# Altium schematic sheet EPS_v6.SchDoc
size A0; PageSetup: Record=PageOptions|CenterHorizontal=True|CenterVertical=True|PrintScale=0.45|XCorrection=1.00|YCorrection=1.00|PrintKind=2|BorderSize=5000000|LeftOffset=1|BottomOffset=1|Orientation=2|PaperLength=1000|PaperWidth=1000|Scale=100|PaperSource=7|PrintQuality=-4|MediaType=1|DitherType=10|PrintScaleMode=1|PaperKind=A4
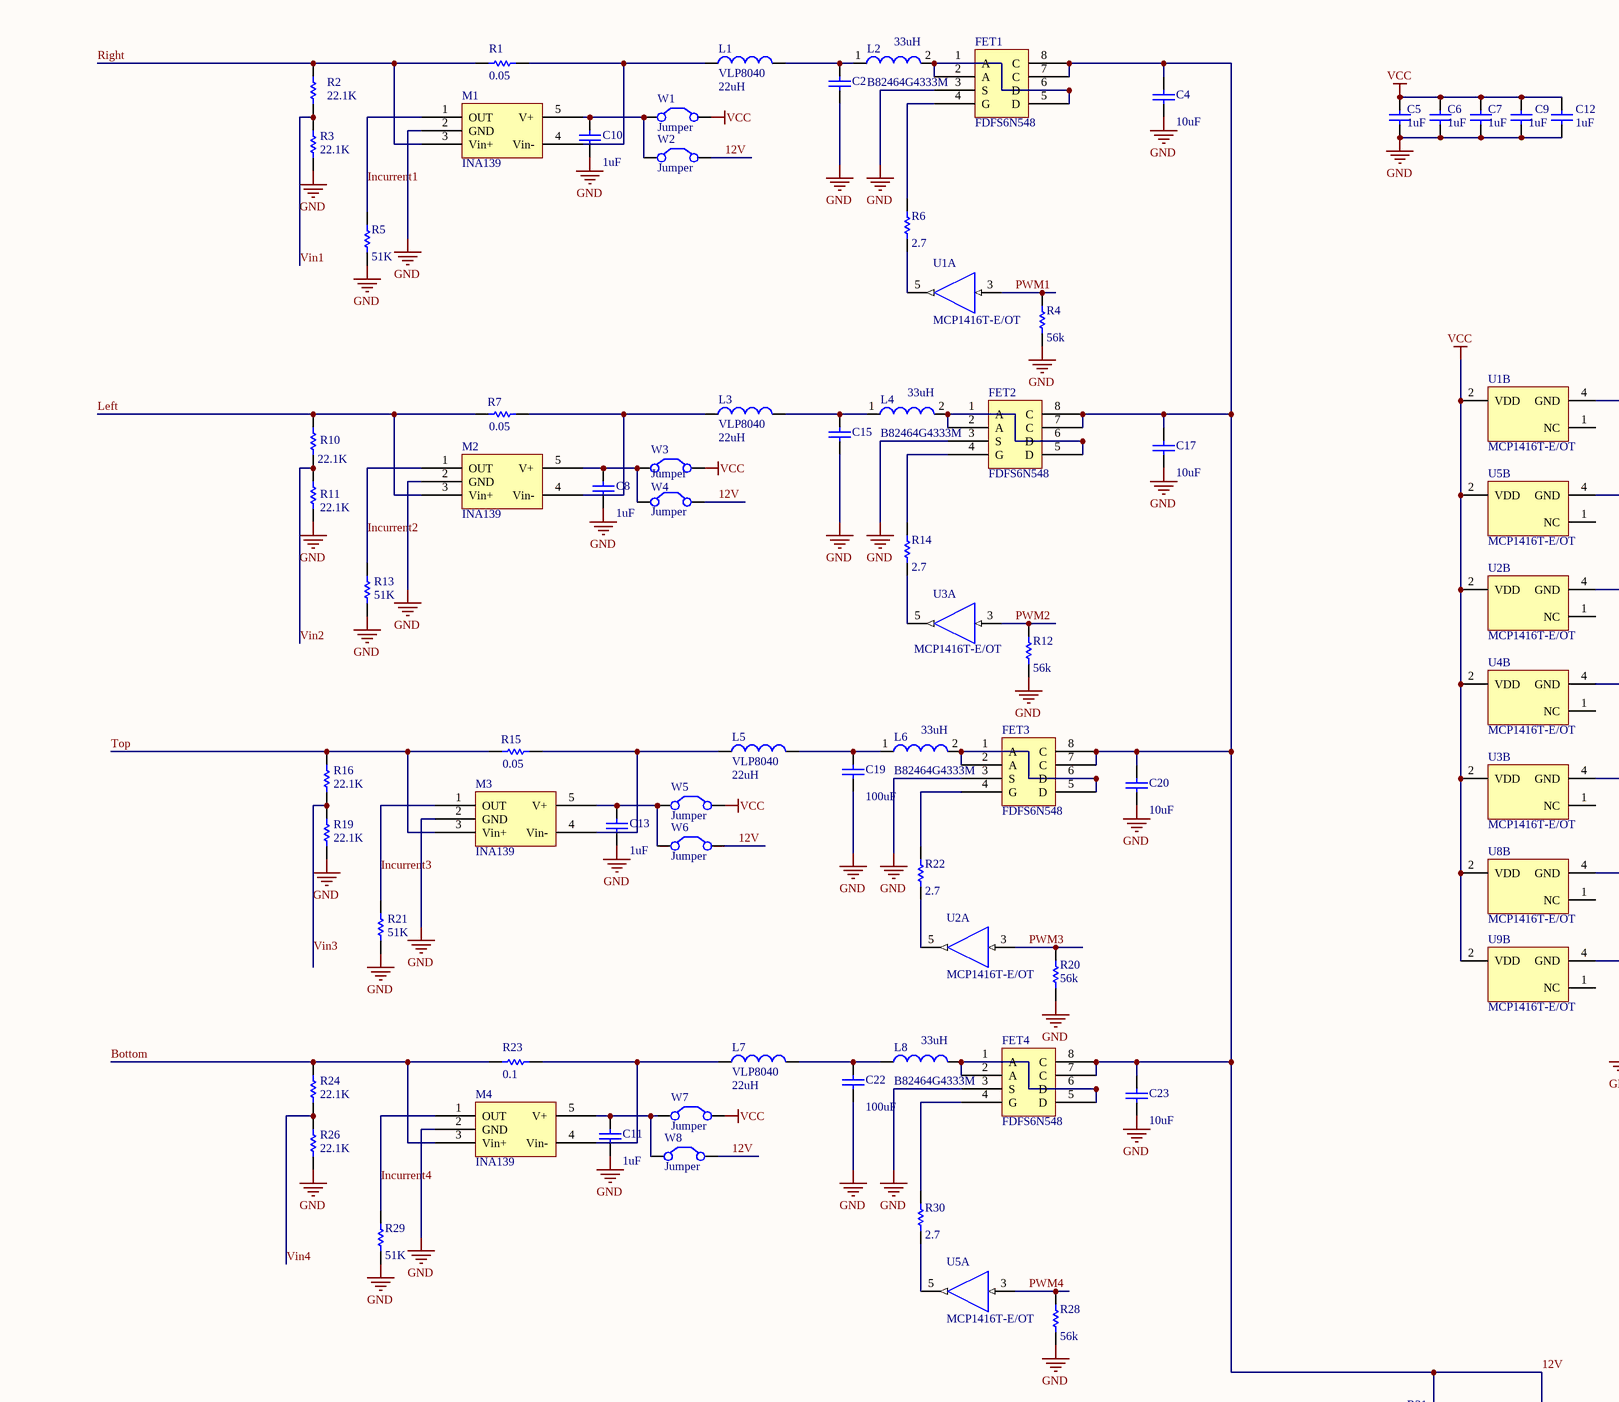
[diagram p0: EPS_v6.SchDoc, top left]
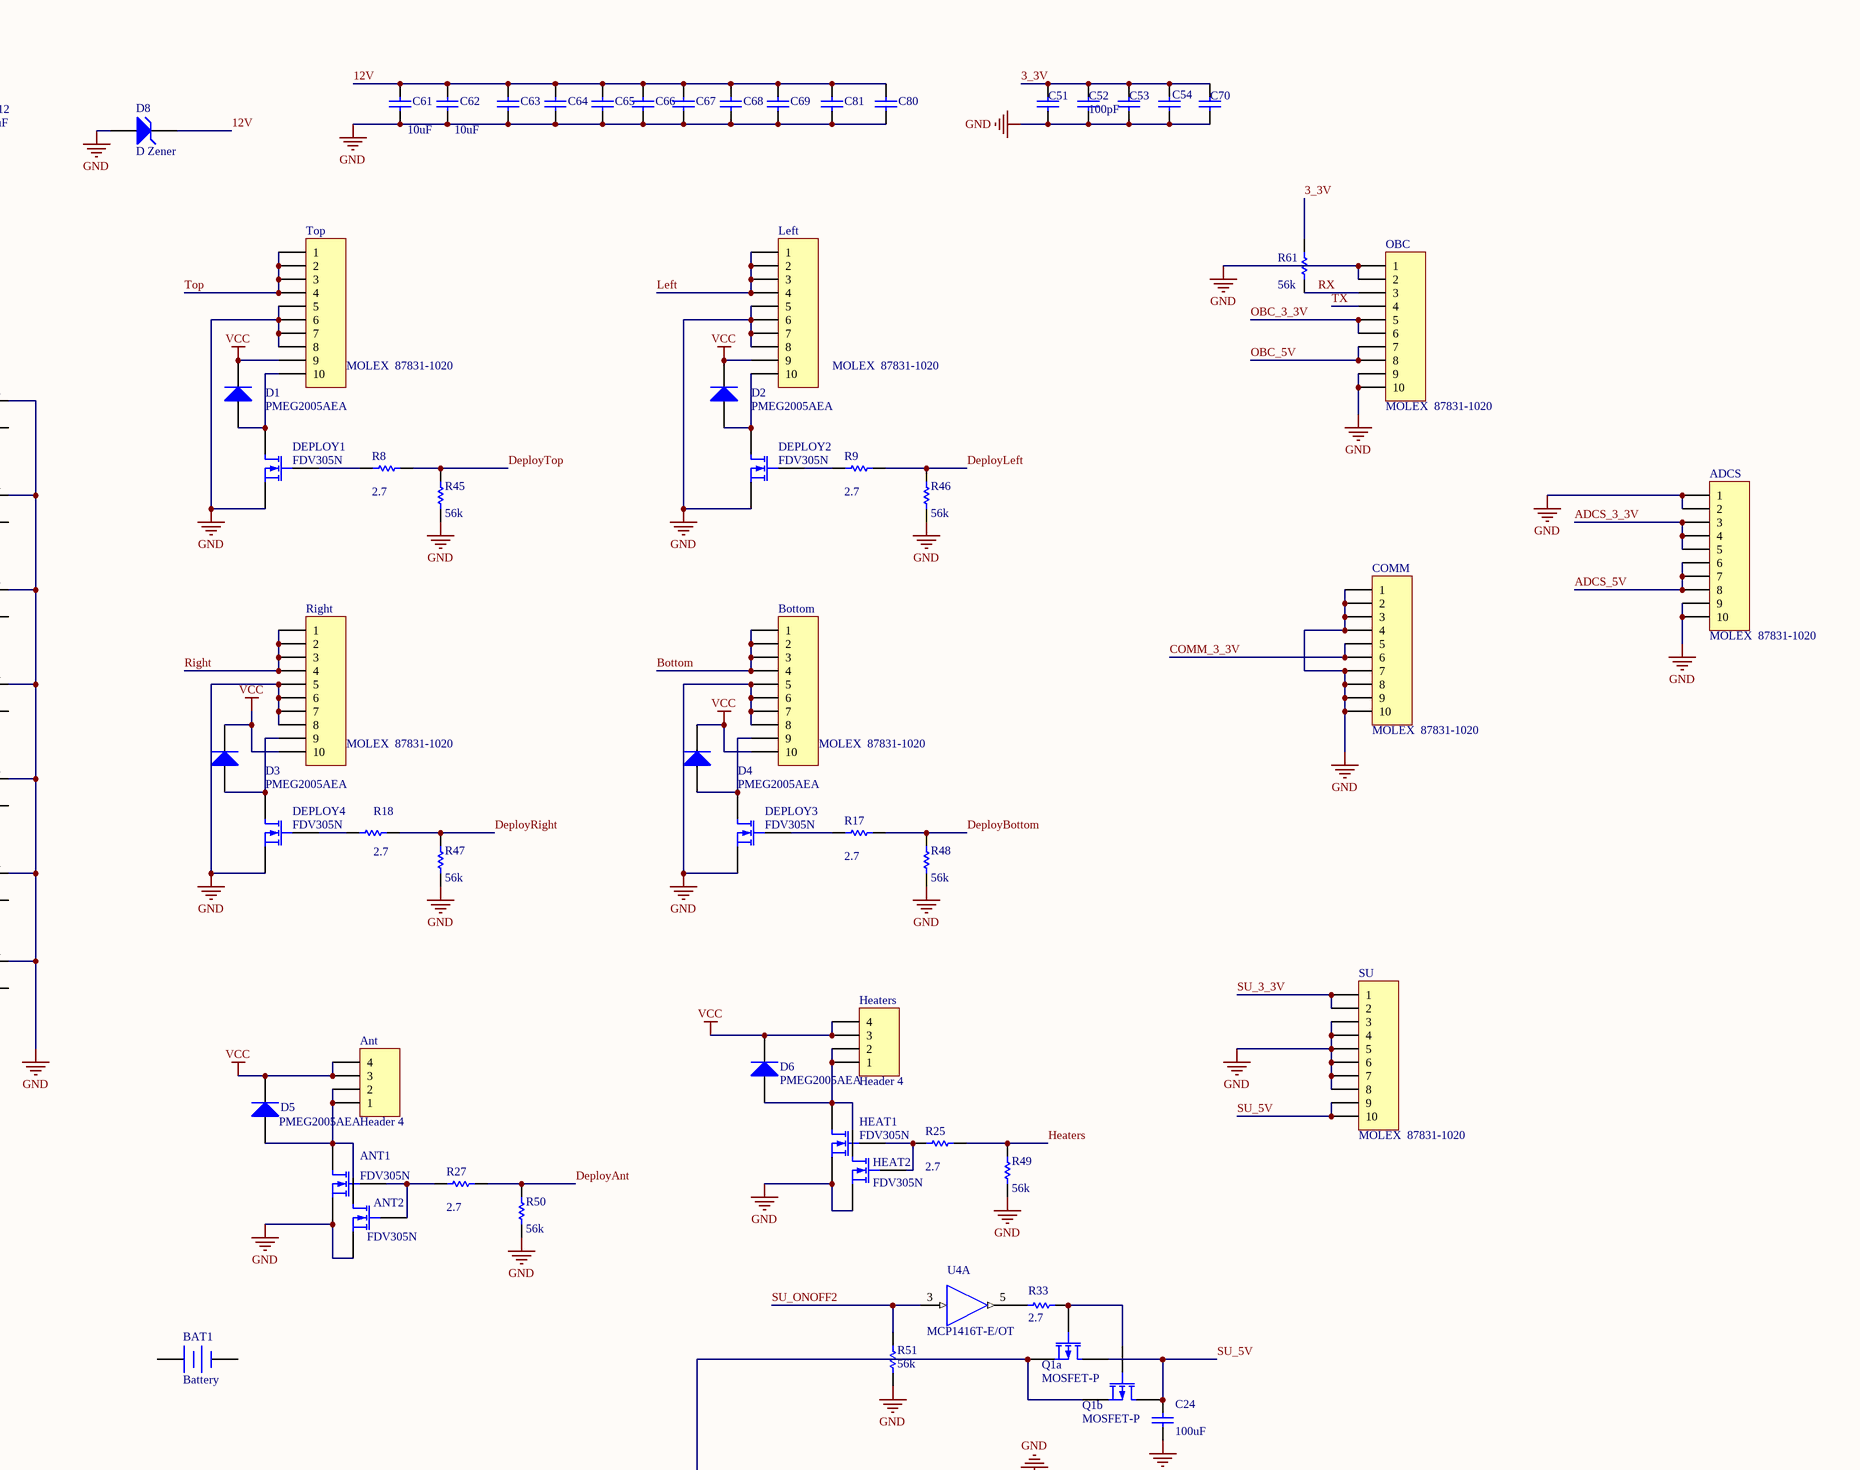
[diagram p1: EPS_v6.SchDoc, top right]
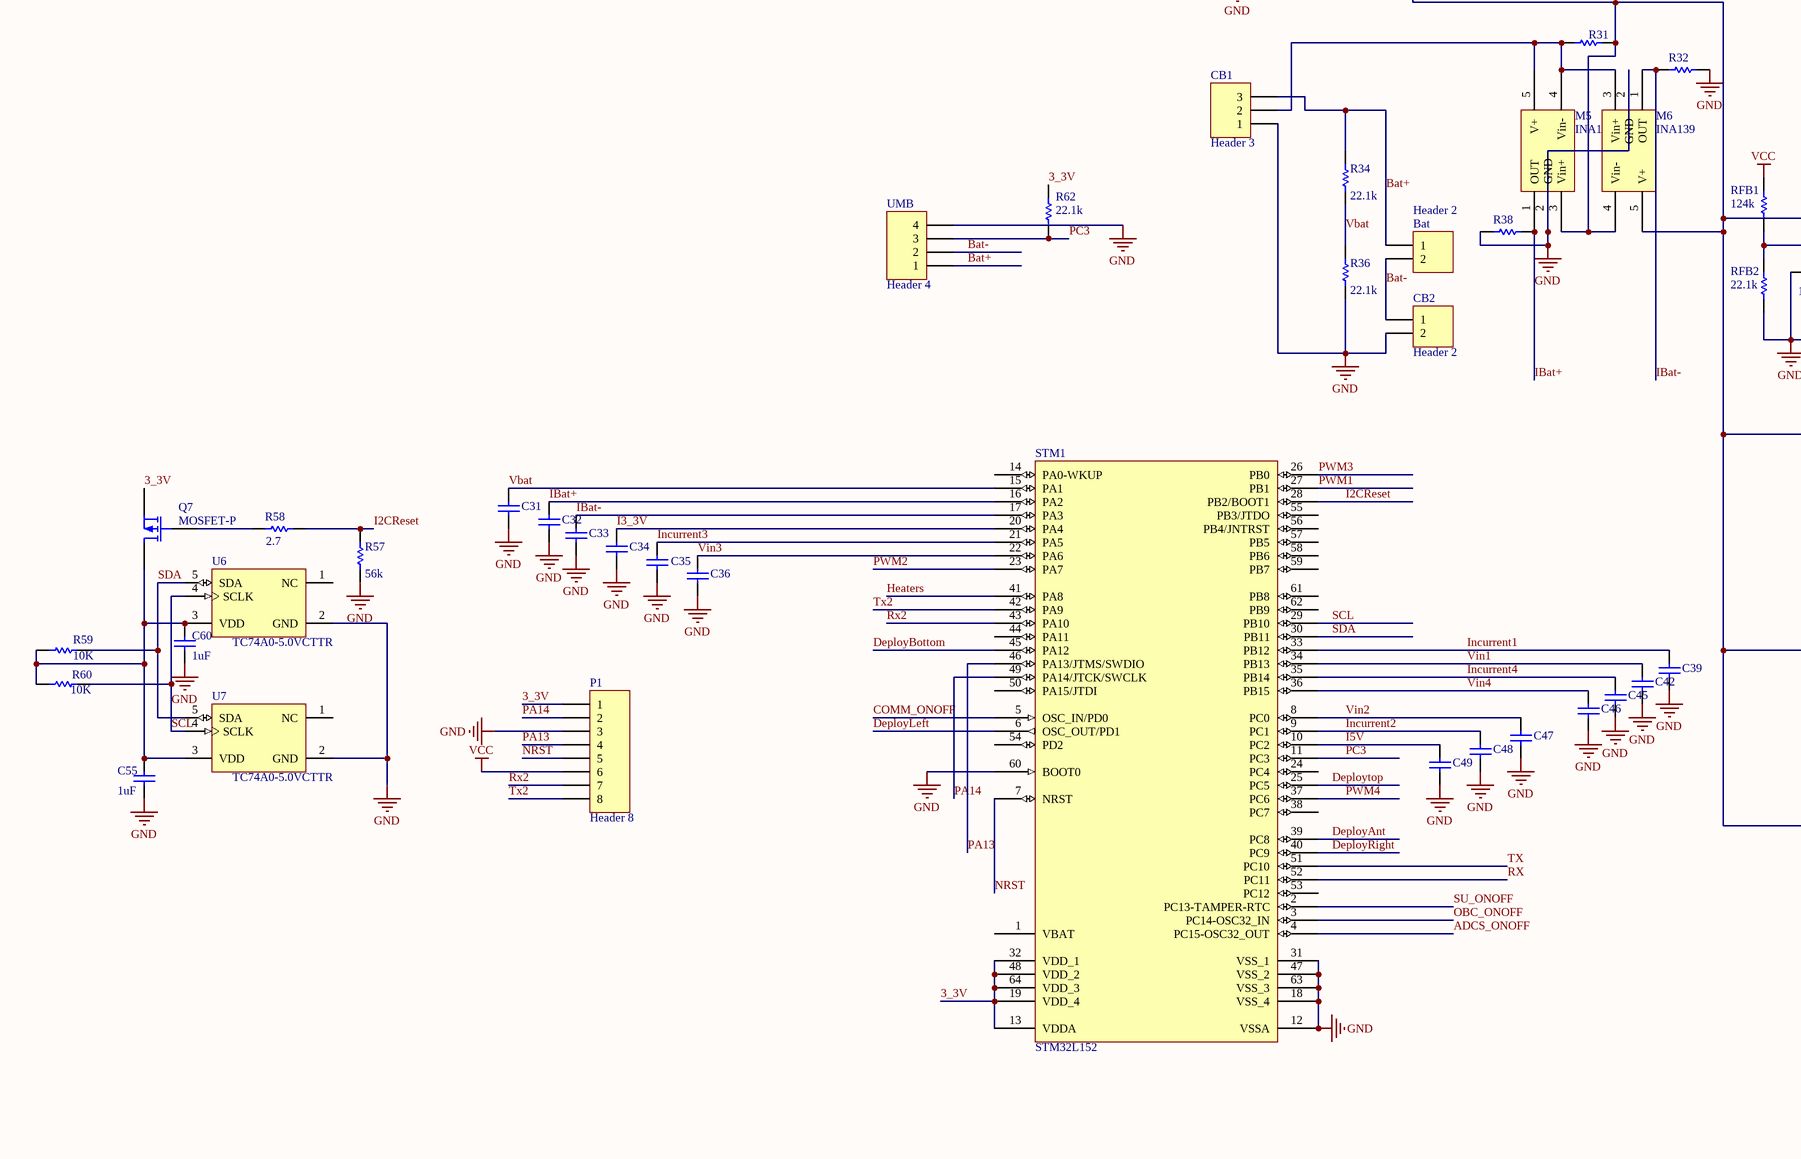
[diagram p2: EPS_v6.SchDoc, bottom left]
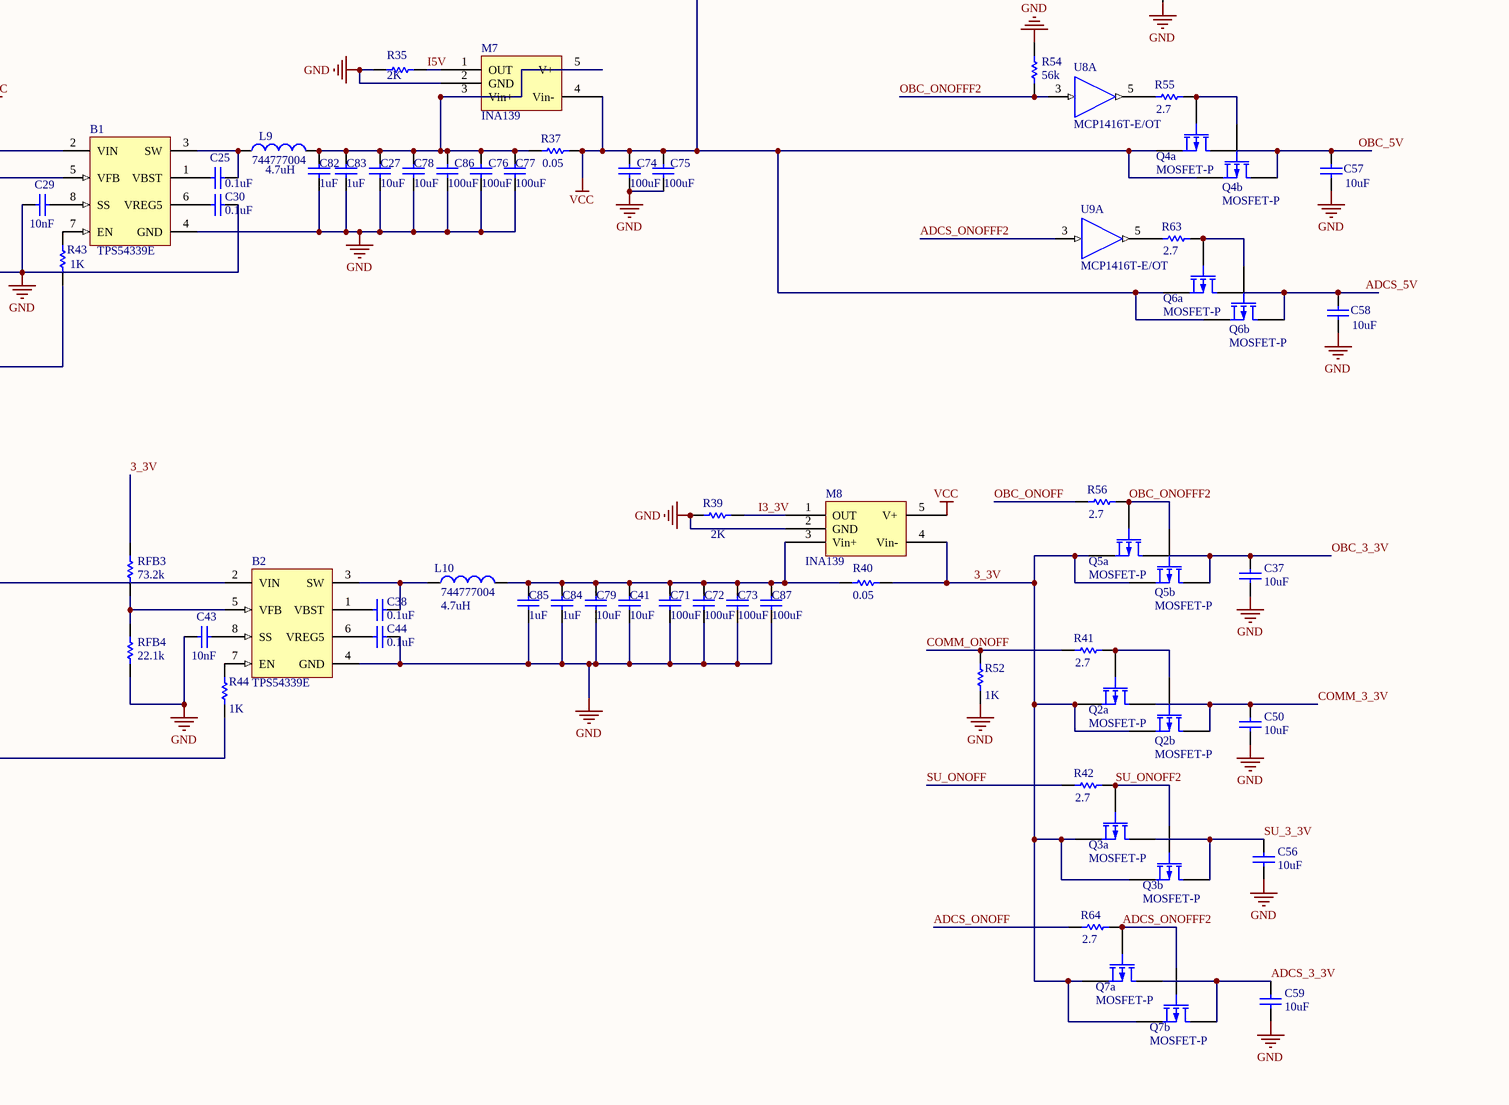
[diagram p3: EPS_v6.SchDoc, bottom right]

## Parts
ADCS  MOLEX  87831-1020  [2mm pitch con]
Ant  Header 4  [2mm4way2row]
ANT1  FDV305N  [SOT-23_M]
ANT2  FDV305N  [SOT-23_M]
B1  TPS54339E  [DDA]
B2  TPS54339E  [DDA]
Bat  Header 2  [Connector]
BAT1  Battery  [18650_pack]
Bottom  MOLEX  87831-1020  [2mm pitch con]
C2  Cap  [C1210_M]  (value not drawn)
C4  value 10uF  [C0805]  (hidden comment: Cap)
C5  value 1uF  [1608[0603]]  (hidden comment: Cap)
C6  value 1uF  [1608[0603]]  (hidden comment: Cap)
C7  value 1uF  [1608[0603]]  (hidden comment: Cap)
C8  value 1uF  [1608[0603]]  (hidden comment: Cap)
C9  value 1uF  [1608[0603]]  (hidden comment: Cap)
C10  value 1uF  [1608[0603]]  (hidden comment: Cap)
C11  value 1uF  [1608[0603]]  (hidden comment: Cap)
C12  value 1uF  [1608[0603]]  (hidden comment: Cap)
C13  value 1uF  [1608[0603]]  (hidden comment: Cap)
C15  Cap  [C1210_M]  (value not drawn)
C17  value 10uF  [C0805]  (hidden comment: Cap)
C19  value 100uF  [C1210_M]  (hidden comment: Cap)
C20  value 10uF  [C0805]  (hidden comment: Cap)
C22  value 100uF  [C1210_M]  (hidden comment: Cap)
C23  value 10uF  [C0805]  (hidden comment: Cap)
C24  value 100uF  [C0805]  (hidden comment: Cap)
C25  value 0.1uF  [1608[0603]]  (hidden comment: Cap)
C27  value 10uF  [C0805]  (hidden comment: Cap)
C29  value 10nF  [1608[0603]]  (hidden comment: Cap)
C30  value 0.1uF  [1608[0603]]  (hidden comment: Cap)
C31  Cap  [1608[0603]]  (value not drawn)
C32  Cap  [1608[0603]]  (value not drawn)
C33  Cap  [1608[0603]]  (value not drawn)
C34  Cap  [1608[0603]]  (value not drawn)
C35  Cap  [1608[0603]]  (value not drawn)
C36  Cap  [1608[0603]]  (value not drawn)
C37  value 10uF  [C0805]  (hidden comment: Cap)
C38  value 0.1uF  [1608[0603]]  (hidden comment: Cap)
C39  Cap  [1608[0603]]  (value not drawn)
C41  value 10uF  [C0805]  (hidden comment: Cap)
C42  Cap  [1608[0603]]  (value not drawn)
C43  value 10nF  [1608[0603]]  (hidden comment: Cap)
C44  value 0.1uF  [1608[0603]]  (hidden comment: Cap)
C45  Cap  [1608[0603]]  (value not drawn)
C46  Cap  [1608[0603]]  (value not drawn)
C47  Cap  [1608[0603]]  (value not drawn)
C48  Cap  [1608[0603]]  (value not drawn)
C49  Cap  [1608[0603]]  (value not drawn)
C50  value 10uF  [C0805]  (hidden comment: Cap)
C51  Cap  [1608[0603]]  (value not drawn)
C52  value 100pF  [1608[0603]]  (hidden comment: Cap)
C53  Cap  [1608[0603]]  (value not drawn)
C54  Cap  [C0805]  (value not drawn)
C55  value 1uF  [1608[0603]]  (hidden comment: Cap)
C56  value 10uF  [C0805]  (hidden comment: Cap)
C57  value 10uF  [C0805]  (hidden comment: Cap)
C58  value 10uF  [C0805]  (hidden comment: Cap)
C59  value 10uF  [C0805]  (hidden comment: Cap)
C60  value 1uF  [1608[0603]]  (hidden comment: Cap)
C61  value 10uF  [C0805]  (hidden comment: Cap)
C62  value 10uF  [C0805]  (hidden comment: Cap)
C63  Cap  [C1206]  (value not drawn)
C64  Cap  [C1206]  (value not drawn)
C65  Cap  [C1206]  (value not drawn)
C66  Cap  [C1206]  (value not drawn)
C67  Cap  [C1206]  (value not drawn)
C68  Cap  [C1206]  (value not drawn)
C69  Cap  [C1206]  (value not drawn)
C70  Cap  [C1206]  (value not drawn)
C71  value 100uF  [C1206]  (hidden comment: Cap)
C72  value 100uF  [C1206]  (hidden comment: Cap)
C73  value 100uF  [C1206]  (hidden comment: Cap)
C74  value 100uF  [C1210]  (hidden comment: Cap)
C75  value 100uF  [C1210]  (hidden comment: Cap)
C76  value 100uF  [C1210]  (hidden comment: Cap)
C77  value 100uF  [C1210]  (hidden comment: Cap)
C78  value 10uF  [C0805]  (hidden comment: Cap)
C79  value 10uF  [C0805]  (hidden comment: Cap)
C80  Cap  [1608[0603]]  (value not drawn)
C81  Cap  [1608[0603]]  (value not drawn)
C82  value 1uF  [1608[0603]]  (hidden comment: Cap)
C83  value 1uF  [1608[0603]]  (hidden comment: Cap)
C84  value 1uF  [1608[0603]]  (hidden comment: Cap)
C85  value 1uF  [1608[0603]]  (hidden comment: Cap)
C86  value 100uF  [C1210]  (hidden comment: Cap)
C87  value 100uF  [C1206]  (hidden comment: Cap)
CB1  Header 3  [Connector_3]
CB2  Header 2  [Connector]
COMM  MOLEX  87831-1020  [2mm pitch con]
D1  PMEG2005AEA  [SOD323 - duplicate]
D2  PMEG2005AEA  [SOD323 - duplicate]
D3  PMEG2005AEA  [SOD323 - duplicate]
D4  PMEG2005AEA  [SOD323 - duplicate]
D5  PMEG2005AEA  [SOD323 - duplicate]
D6  PMEG2005AEA  [SOD323 - duplicate]
D8  D Zener  [BZG03C]
DEPLOY1  FDV305N  [SOT-23_M]
DEPLOY2  FDV305N  [SOT-23_M]
DEPLOY3  FDV305N  [SOT-23_M]
DEPLOY4  FDV305N  [SOT-23_M]
FET1  FDFS6N548  [SO8_M]
FET2  FDFS6N548  [SO8_M]
FET3  FDFS6N548  [SO8_M]
FET4  FDFS6N548  [SO8_M]
HEAT1  FDV305N  [SOT-23_M]
HEAT2  FDV305N  [SOT-23_M]
Heaters  Header 4  [2mm4way2row]
L1  VLP8040  value 22uH  [22uH2.2A]
L2  B82464G4333M  Inductance: 33uH  [EPCOS104x104]
L3  VLP8040  value 22uH  [22uH2.2A]
L4  B82464G4333M  Inductance: 33uH  [EPCOS104x104]
L5  VLP8040  value 22uH  [22uH2.2A]
L6  B82464G4333M  Inductance: 33uH  [EPCOS104x104]
L7  VLP8040  value 22uH  [27uH1A]
L8  B82464G4333M  value 33uH  [EPCOS104x104]
L9  744777004  value 4.7uH  [4.7uH4A]
L10  744777004  value 4.7uH  [4.7uH4A]
Left  MOLEX  87831-1020  [2mm pitch con]
M1  INA139  [SOT-23-OT5_N]
M2  INA139  [SOT-23-OT5_N]
M3  INA139  [SOT-23-OT5_N]
M4  INA139  [SOT-23-OT5_N]
M5  INA139  [SOT-23-OT5_N]
M6  INA139  [SOT-23-OT5_N]
M7  INA139  [SOT-23-OT5_N]
M8  INA139  [SOT-23-OT5_N]
OBC  MOLEX  87831-1020  [2mm pitch con]
P1  Header 8  [Header 1.5mm pitch 8way]
Q1a  MOSFET-P  [SOT-23_M]
Q1b  MOSFET-P  [SOT-23_M]
Q2a  MOSFET-P  [SOT-23_M]
Q2b  MOSFET-P  [SOT-23_M]
Q3a  MOSFET-P  [SOT-23_M]
Q3b  MOSFET-P  [SOT-23_M]
Q4a  MOSFET-P  [SOT-23_M]
Q4b  MOSFET-P  [SOT-23_M]
Q5a  MOSFET-P  [SOT-23_M]
Q5b  MOSFET-P  [SOT-23_M]
Q6a  MOSFET-P  [SOT-23_M]
Q6b  MOSFET-P  [SOT-23_M]
Q7  MOSFET-P  [SOT-23_M]
Q7a  MOSFET-P  [SOT-23_M]
Q7b  MOSFET-P  [SOT-23_M]
R1  value 0.05  [J1-0603]  (hidden comment: Res1)
R2  value 22.1K  [J1-0603]  (hidden comment: Res1)
R3  value 22.1K  [J1-0603]  (hidden comment: Res1)
R4  value 56k  [J1-0603]  (hidden comment: Res1)
R5  value 51K  [J1-0603]  (hidden comment: Res1)
R6  value 2.7  [J1-0603]  (hidden comment: Res1)
R7  value 0.05  [J1-0603]  (hidden comment: Res1)
R8  value 2.7  [J1-0603]  (hidden comment: Res1)
R9  value 2.7  [J1-0603]  (hidden comment: Res1)
R10  value 22.1K  [J1-0603]  (hidden comment: Res1)
R11  value 22.1K  [J1-0603]  (hidden comment: Res1)
R12  value 56k  [J1-0603]  (hidden comment: Res1)
R13  value 51K  [J1-0603]  (hidden comment: Res1)
R14  value 2.7  [J1-0603]  (hidden comment: Res1)
R15  value 0.05  [J1-0603]  (hidden comment: Res1)
R16  value 22.1K  [J1-0603]  (hidden comment: Res1)
R17  value 2.7  [J1-0603]  (hidden comment: Res1)
R18  value 2.7  [J1-0603]  (hidden comment: Res1)
R19  value 22.1K  [J1-0603]  (hidden comment: Res1)
R20  value 56k  [J1-0603]  (hidden comment: Res1)
R21  value 51K  [J1-0603]  (hidden comment: Res1)
R22  value 2.7  [J1-0603]  (hidden comment: Res1)
R23  value 0.1  [J1-0603]  (hidden comment: Res1)
R24  value 22.1K  [J1-0603]  (hidden comment: Res1)
R25  value 2.7  [J1-0603]  (hidden comment: Res1)
R26  value 22.1K  [J1-0603]  (hidden comment: Res1)
R27  value 2.7  [J1-0603]  (hidden comment: Res1)
R28  value 56k  [J1-0603]  (hidden comment: Res1)
R29  value 51K  [J1-0603]  (hidden comment: Res1)
R30  value 2.7  [J1-0603]  (hidden comment: Res1)
R31  Res1  [J1-0603]  (value not drawn)
R32  Res1  [J1-0603]  (value not drawn)
R33  value 2.7  [J1-0603]  (hidden comment: Res1)
R34  value 22.1k  [J1-0603]  (hidden comment: Res1)
R35  value 2K  [J1-0603]  (hidden comment: Res1)
R36  value 22.1k  [J1-0603]  (hidden comment: Res1)
R37  value 0.05  [J1-0603]  (hidden comment: Res1)
R38  Res1  [J1-0603]  (value not drawn)
R39  value 2K  [J1-0603]  (hidden comment: Res1)
R40  value 0.05  [J1-0603]  (hidden comment: Res1)
R41  value 2.7  [J1-0603]  (hidden comment: Res1)
R42  value 2.7  [J1-0603]  (hidden comment: Res1)
R43  value 1K  [J1-0603]  (hidden comment: Res1)
R44  value 1K  [J1-0603]  (hidden comment: Res1)
R45  value 56k  [J1-0603]  (hidden comment: Res1)
R46  value 56k  [J1-0603]  (hidden comment: Res1)
R47  value 56k  [J1-0603]  (hidden comment: Res1)
R48  value 56k  [J1-0603]  (hidden comment: Res1)
R49  value 56k  [J1-0603]  (hidden comment: Res1)
R50  value 56k  [J1-0603]  (hidden comment: Res1)
R51  value 56k  [J1-0603]  (hidden comment: Res1)
R52  value 1K  [J1-0603]  (hidden comment: Res1)
R54  value 56k  [J1-0603]  (hidden comment: Res1)
R55  value 2.7  [J1-0603]  (hidden comment: Res1)
R56  value 2.7  [J1-0603]  (hidden comment: Res1)
R57  value 56k  [J1-0603]  (hidden comment: Res1)
R58  value 2.7  [J1-0603]  (hidden comment: Res1)
R59  value 10K  [J1-0603]  (hidden comment: Res1)
R60  value 10K  [J1-0603]  (hidden comment: Res1)
R61  value 56k  [J1-0603]  (hidden comment: Res1)
R62  value 22.1k  [J1-0603]  (hidden comment: Res1)
R63  value 2.7  [J1-0603]  (hidden comment: Res1)
R64  value 2.7  [J1-0603]  (hidden comment: Res1)
RFB1  value 124k  [J1-0603]  (hidden comment: Res1)
RFB2  value 22.1k  [J1-0603]  (hidden comment: Res1)
RFB3  value 73.2k  [J1-0603]  (hidden comment: Res1)
RFB4  value 22.1k  [J1-0603]  (hidden comment: Res1)
Right  MOLEX  87831-1020  [2mm pitch con]
STM1  STM32L152  [LQFP64_M]
SU  MOLEX  87831-1020  [2mm pitch con]
Top  MOLEX  87831-1020  [2mm pitch con]
U1  MCP1416T-E/OT  [SOT-23-OT5_N]  (parts A,B of 2)
U2  MCP1416T-E/OT  [SOT-23-OT5_N]  (parts A,B of 2)
U3  MCP1416T-E/OT  [SOT-23-OT5_N]  (parts A,B of 2)
U4  MCP1416T-E/OT  [SOT-23-OT5_N]  (parts A,B of 2)
U5  MCP1416T-E/OT  [SOT-23-OT5_N]  (parts A,B of 2)
U6  TC74A0-5.0VCTTR  [SOT-23-CT5_N]
U7  TC74A0-5.0VCTTR  [SOT-23-CT5_N]
U8  MCP1416T-E/OT  [SOT-23-OT5_N]  (parts A,B of 2)
U9  MCP1416T-E/OT  [SOT-23-OT5_N]  (parts A,B of 2)
UMB  Header 4  [2mm4way2row]
W1  Jumper  [J1-0603]
W2  Jumper  [J1-0603]
W3  Jumper  [J1-0603]
W4  Jumper  [J1-0603]
W5  Jumper  [J1-0603]
W6  Jumper  [J1-0603]
W7  Jumper  [J1-0603]
W8  Jumper  [J1-0603]

## Nets
GND: ADCS.1 ADCS.2 ADCS.9 ADCS.10 ANT1.2(S) ANT2.2(S) B1.4(GND) B2.4(GND) Bottom.5 Bottom.6 Bottom.7 Bottom.8 C2.1 C4.1 C5.1 C6.1 C7.1 C8.1 C9.1 C10.1 C11.1 C12.1 C13.1 C15.1 C17.1 C19.1 C20.1 C22.1 C23.1 C24.1 C27.1 C29.1 C30.2 C31.1 C32.1 C33.1 C34.1 C35.1 C36.1 C37.1 C39.1 C41.1 C42.1 C43.1 C44.2 C45.1 C46.1 C47.1 C48.1 C49.1 C50.1 C51.2 C52.2 C53.2 C54.2 C55.2 C56.1 C57.2 C58.2 C59.1 C60.2 C61.1 C62.1 C63.1 C64.1 C65.1 C66.1 C67.1 C68.1 C69.1 C70.1 C71.1 C72.1 C73.1 C74.2 C75.2 C76.2 C77.2 C78.2 C79.1 C80.1 C81.1 C82.1 C83.1 C84.1 C85.1 C86.2 C87.2 CB1.1 CB2.2 COMM.1 COMM.2 COMM.3 COMM.4 COMM.7 COMM.8 COMM.9 COMM.10 D8.1(A) DEPLOY1.2(S) DEPLOY2.3(S) DEPLOY3.2(S) DEPLOY4.2(S) FET1.3(S) FET2.3(S) FET3.3(S) FET4.3(S) HEAT1.2(S) HEAT2.2(S) Left.5 Left.6 Left.7 Left.8 M1.2(GND) M2.2(GND) M3.2(GND) M4.2(GND) M5.2(GND) M6.2(GND) M7.2(GND) M8.2(GND) OBC.1 OBC.2 OBC.9 OBC.10 P1.3 R3.1 R4.2 R5.1 R11.1 R12.2 R13.1 R19.1 R20.2 R21.1 R26.1 R28.2 R29.1 R32.2 R35.1 R36.1 R38.1 R39.1 R45.1 R46.1 R47.1 R48.1 R49.1 R50.1 R51.2 R52.1 R54.2 R57.1 RFB2.1 RFB4.1 Right.5 Right.6 Right.7 Right.8 STM1.12(VSSA) STM1.18(VSS_4) STM1.31(VSS_1) STM1.47(VSS_2) STM1.60(BOOT0) STM1.63(VSS_3) SU.3 SU.4 SU.5 SU.6 SU.7 SU.8 Top.5 Top.6 Top.7 Top.8 U1.4(GND) U2.4(GND) U3.4(GND) U4.4(GND) U5.4(GND) U6.2(GND) U7.2(GND) U8.4(GND) U9.4(GND) UMB.4
VCC: Ant.3 Ant.4 Bottom.10 C5.2 C6.2 C7.2 C9.2 C12.2 C74.1 C75.1 D1.2(K) D2.2(K) D3.2(K) D4.2(K) D5.2(K) D6.2(K) Heaters.3 Heaters.4 Left.9 M7.4(Vin-) M8.5(V+) P1.6 Q1a.2(S) Q1b.2(S) Q4a.2(S) Q4b.2(S) Q6a.2(S) Q6b.2(S) R37.1 RFB1.2 Right.10 Top.9 U1.2(VDD) U2.2(VDD) U3.2(VDD) U4.2(VDD) U5.2(VDD) U8.2(VDD) U9.2(VDD) W1.2(C2) W3.2(C2) W5.2(C2) W7.2(C2)
3_3V: C51.1 C52.1 C53.1 C54.1 C70.2 M8.4(Vin-) P1.1 Q2a.2(S) Q2b.2(S) Q3a.2(S) Q3b.2(S) Q5a.2(S) Q5b.2(S) Q7.2(S) Q7a.2(S) Q7b.2(S) R40.1 R61.1 R62.2 RFB3.2 STM1.13(VDDA) STM1.19(VDD_4) STM1.32(VDD_1) STM1.48(VDD_2) STM1.64(VDD_3)
12V: B1.2(VIN) B2.2(VIN) C4.2 C17.2 C20.2 C23.2 C61.2 C62.2 C63.2 C64.2 C65.2 C66.2 C67.2 C68.2 C69.2 C80.2 C81.2 D8.2(K) FET1.7(C) FET1.8(C) FET2.7(C) FET2.8(C) FET3.7(C) FET3.8(C) FET4.7(C) FET4.8(C) M5.3(Vin+) M6.4(Vin-) M6.5(V+) R31.1 R43.1 R44.1 W2.2(C2) W4.2(C2) W6.2(C2) W8.2(C2)
ADCS_3_3V: ADCS.3 ADCS.4 ADCS.5 C59.2 Q7a.3(D) Q7b.3(D)
ADCS_5V: ADCS.6 ADCS.7 ADCS.8 C58.1 Q6a.3(D) Q6b.3(D)
ADCS_ONOFF: R64.2 STM1.4(PC15-OSC32_OUT)
ADCS_ONOFFF2: Q7a.1(G) Q7b.1(G) R64.1 U9.3(IN)
Bat+: Bat.1 CB1.3 R34.2 UMB.1
Bat-: Bat.2 CB2.1 UMB.2
Bottom: Bottom.1 Bottom.2 Bottom.3 Bottom.4 M4.3(Vin+) R23.2 R24.2
COMM_3_3V: C50.2 COMM.5 COMM.6 Q2a.3(D) Q2b.3(D)
COMM_ONOFF: R41.2 R52.2 STM1.5(OSC_IN/PD0)
DeployAnt: R27.2 R50.2 STM1.39(PC8)
DeployBottom: R17.2 R48.2 STM1.45(PA12)
DeployLeft: R9.2 R46.2 STM1.6(OSC_OUT/PD1)
DeployRight: R18.2 R47.2 STM1.40(PC9)
DeployTop: R8.2 R45.2 STM1.25(PC5)
Heaters: R25.2 R49.2 STM1.41(PA8)
I2CReset: R57.2 R58.2 STM1.28(PB2/BOOT1)
I3_3V: C34.2 M8.1(OUT) R39.2 STM1.20(PA4)
I5V: C49.2 M7.1(OUT) R35.2 STM1.10(PC2)
IBat+: C32.2 M5.1(OUT) R38.2 STM1.16(PA2)
IBat-: C33.2 M6.1(OUT) R32.1 STM1.17(PA3)
Incurrent1: C39.2 M1.1(OUT) R5.2 STM1.33(PB12)
Incurrent2: C48.2 M2.1(OUT) R13.2 STM1.9(PC1)
Incurrent3: C35.2 M3.1(OUT) R21.2 STM1.21(PA5)
Incurrent4: C45.2 M4.1(OUT) R29.2 STM1.35(PB14)
Left: Left.1 Left.2 Left.3 Left.4 M2.3(Vin+) R7.2 R10.2
NRST: P1.5 STM1.7(NRST)
OBC_3_3V: C37.2 OBC.5 OBC.6 Q5a.3(D) Q5b.3(D)
OBC_5V: C57.1 OBC.7 OBC.8 Q4a.3(D) Q4b.3(D)
OBC_ONOFF: R56.2 STM1.3(PC14-OSC32_IN)
OBC_ONOFFF2: Q5a.1(G) Q5b.1(G) R54.1 R56.1 U8.3(IN)
PA13: P1.4 STM1.46(PA13/JTMS/SWDIO)
PA14: P1.2 STM1.49(PA14/JTCK/SWCLK)
PC3: R62.1 STM1.11(PC3) UMB.3
PWM1: R4.1 STM1.27(PB1) U1.3(IN)
PWM2: R12.1 STM1.23(PA7) U3.3(IN)
PWM3: R20.1 STM1.26(PB0) U2.3(IN)
PWM4: R28.1 STM1.37(PC6) U5.3(IN)
Right: M1.3(Vin+) R1.2 R2.2 Right.1 Right.2 Right.3 Right.4
RX: OBC.3 R61.2 STM1.52(PC11)
Rx2: P1.7 STM1.43(PA10)
SCL: R60.2 STM1.29(PB10) U6.4(SCLK) U7.4(SCLK)
SDA: R59.2 STM1.30(PB11) U6.5(SDA) U7.5(SDA)
SU_3_3V: C56.2 Q3a.3(D) Q3b.3(D) SU.1 SU.2
SU_5V: C24.2 Q1a.3(D) Q1b.3(D) SU.9 SU.10
SU_ONOFF: R42.2 STM1.2(PC13-TAMPER-RTC)
SU_ONOFF2: Q3a.1(G) Q3b.1(G) R42.1 R51.1 U4.3(IN)
Top: M3.3(Vin+) R15.2 R16.2 Top.1 Top.2 Top.3 Top.4
TX: OBC.4 STM1.51(PC10)
Tx2: P1.8 STM1.42(PA9)
Vbat: C31.2 R34.1 R36.2 STM1.15(PA1)
Vin1: C42.2 R2.1 R3.2 STM1.34(PB13)
Vin2: C47.2 R10.1 R11.2 STM1.8(PC0)
Vin3: C36.2 R16.1 R19.2 STM1.22(PA6)
Vin4: C46.2 R24.1 R26.2 STM1.36(PB15)
NetANT1_1: ANT1.1(G) ANT2.1(G) R27.1
NetAnt_1: Ant.1 Ant.2 ANT1.3(D) ANT2.3(D) D5.1(A)
NetB1_1: B1.1(VBST) C25.1
NetB1_3: B1.3(SW) C25.2 L9.1
NetB1_5: B1.5(VFB) RFB1.1 RFB2.2
NetB1_6: B1.6(VREG5) C30.1
NetB1_7: B1.7(EN) R43.2
NetB1_8: B1.8(SS) C29.2
NetB2_1: B2.1(VBST) C38.1
NetB2_3: B2.3(SW) C38.2 L10.1
NetB2_5: B2.5(VFB) RFB3.1 RFB4.2
NetB2_6: B2.6(VREG5) C44.1
NetB2_7: B2.7(EN) R44.2
NetB2_8: B2.8(SS) C43.2
NetBottom_9: Bottom.9 D4.1(A) DEPLOY3.3(D)
NetC2_2: C2.2 L1.2 L2.1
NetC8_2: C8.2 M2.5(V+) W3.1(C1) W4.1(C1)
NetC10_2: C10.2 M1.5(V+) W1.1(C1) W2.1(C1)
NetC11_2: C11.2 M4.5(V+) W7.1(C1) W8.1(C1)
NetC13_2: C13.2 M3.5(V+) W5.1(C1) W6.1(C1)
NetC15_2: C15.2 L3.2 L4.1
NetC19_2: C19.2 L5.2 L6.1
NetC22_2: C22.2 L7.2 L8.1
NetC27_2: C27.2 C76.1 C77.1 C78.1 C82.2 C83.2 C86.1 L9.2 M7.3(Vin+) M7.5(V+) R37.2
NetC41_2: C41.2 C71.2 C72.2 C73.2 C79.2 C84.2 C85.2 C87.1 L10.2 M8.3(Vin+) R40.2
NetC55_1: C55.1 C60.1 Q7.3(D) R59.1 R60.1 U6.3(VDD) U7.3(VDD)
NetCB1_2: CB1.2 M5.4(Vin-) M5.5(V+) M6.3(Vin+) R31.2
NetD1_1: D1.1(A) DEPLOY1.3(D) Top.10
NetD2_1: D2.1(A) DEPLOY2.1(D) Left.10
NetD3_1: D3.1(A) DEPLOY4.3(D) Right.9
NetD6_1: D6.1(A) HEAT1.3(D) HEAT2.3(D) Heaters.1 Heaters.2
NetDEPLOY1_1: DEPLOY1.1(G) R8.1
NetDEPLOY2_2: DEPLOY2.2(G) R9.1
NetDEPLOY3_1: DEPLOY3.1(G) R17.1
NetDEPLOY4_1: DEPLOY4.1(G) R18.1
NetFET1_1: FET1.1(A) FET1.2(A) FET1.5(D) FET1.6(D) L2.2
NetFET1_4: FET1.4(G) R6.2
NetFET2_1: FET2.1(A) FET2.2(A) FET2.5(D) FET2.6(D) L4.2
NetFET2_4: FET2.4(G) R14.2
NetFET3_1: FET3.1(A) FET3.2(A) FET3.5(D) FET3.6(D) L6.2
NetFET3_4: FET3.4(G) R22.2
NetFET4_1: FET4.1(A) FET4.2(A) FET4.5(D) FET4.6(D) L8.2
NetFET4_4: FET4.4(G) R30.2
NetHEAT1_1: HEAT1.1(G) HEAT2.1(G) R25.1
NetL1_1: L1.1 M1.4(Vin-) R1.1
NetL3_1: L3.1 M2.4(Vin-) R7.1
NetL5_1: L5.1 M3.4(Vin-) R15.1
NetL7_1: L7.1 M4.4(Vin-) R23.1
NetQ1a_1: Q1a.1(G) Q1b.1(G) R33.1
NetQ2a_1: Q2a.1(G) Q2b.1(G) R41.1
NetQ4a_1: Q4a.1(G) Q4b.1(G) R55.1
NetQ6a_1: Q6a.1(G) Q6b.1(G) R63.1
NetQ7_1: Q7.1(G) R58.1
NetR6_1: R6.1 U1.5(OUT)
NetR14_1: R14.1 U3.5(OUT)
NetR22_1: R22.1 U2.5(OUT)
NetR30_1: R30.1 U5.5(OUT)
NetR33_2: R33.2 U4.5(OUT)
NetR55_2: R55.2 U8.5(OUT)
NetR63_2: R63.2 U9.5(OUT)

Not connected (* = marked no-connect by the designer): BAT1 1(+) 2(-); STM1 1(VBAT) 14(PA0-WKUP) 24(PC4) 38(PC7) 44(PA11) 50(PA15/JTDI) 53(PC12) 54(PD2) 55(PB3/JTDO) 56(PB4/JNTRST) 57(PB5) 58(PB6) 59(PB7) 61(PB8) 62(PB9); U1 1(NC); U2 1(NC); U3 1(NC); U4 1(NC); U5 1(NC); U6 1(NC); U7 1(NC); U8 1(NC); U9 1(NC)

## Library data of the parts
ADCS Bottom COMM Left OBC Right SU Top = Header 10: Header, 10-Pin; LatestRevisionDate: 17-Jul-2002; LatestRevisionNote: Re-released for DXP Platform.; Publisher: Altium Limited
Ant Heaters UMB = Header 4: Header, 4-Pin; LatestRevisionDate: 17-Jul-2002; LatestRevisionNote: Re-released for DXP Platform.; Publisher: Altium Limited
ANT1 ANT2 DEPLOY1 DEPLOY3 DEPLOY4 HEAT1 HEAT2 = MOSFET-N: N-Channel MOSFET; Published: 8-Jun-2000; LatestRevisionDate: 17-Jul-2002; LatestRevisionNote: Re-released for DXP Platform.; PackageVersion: 1995/1996; PackageReference: E3; Publisher: Altium Limited; PackageDescription: TO, Flat Index; 3 In-Line, Axial Leads; Body Dia. 4.6mm; Lead Dia. 0.5 mm (max)
B1 B2 = TPS54228D: Buck Step Down Regulator with 4.5 to 18 V Input and 0.76 to 7 V Output, -40 to 85 degC, 8-Pin SOIC (D), Green (RoHS & no Sb/Br); Manufacturer: Texas Instruments; Duty Cycle(Max)(%): 90; Iout(Max)(A): 2; Iq(Typ)(mA): 0.8; Rating: Catalog; Regulated Outputs(#): 1; SubFamily: Step-Down Regulator; Switch Current Limit(Typ)(A): 3.3; Synchronous Rectification: TRUE; Vin(Max)(V): 18; Vin(Min)(V): 4.5; Vout(Max)(V): 7; Vout(Min)(V): 0.76; DatasheetVersion: SLVSAU1C; PackageVersion: revM, Jun-2011; PackageReference: D8; PackageDescription: 8-Pin Plastic Small Outline Integrated Circuit, 4.9 x 3.9 mm, Pitch 1.27 mm Pitch; Supplier 1: Digi-Key; Supplier Part Number 1: 296-30158-5-ND; Supplier 2: Farnell; Supplier Part Number 2: 2078515; Supplier 3: Newark; Supplier Part Number 3: 82T9729; Supplier 4: Newark; Supplier Part Number 4: 76T8129; Supplier 5: Mouser; Supplier Part Number 5: 595-TPS54228D; Eco-Plan: Green (RoHS & no Sb/Br); Topology: Buck; Mounting Technology: Surface Mount; Code_JEDEC: MS-012AA; PartNumber: TPS54228D; ComponentLink1Description: Datasheet; ComponentLink1URL: http://www.ti.com/general/docs/lit/getliterature.tsp?genericPartNumber=TPS54228&fileType=pdf; ComponentLink2Description: Package Specification; ComponentLink2URL: http://www.ti.com/litv/pdf/msoi002j; ComponentLink3Description: URL Link1; ComponentLink3URL: Samples URL:http://www.ti.com/product/tps54228#samples
Bat CB2 = Header 2: Header, 2-Pin; LatestRevisionDate: 17-Jul-2002; LatestRevisionNote: Re-released for DXP Platform.; Publisher: Altium Limited
BAT1 = Battery: Multicell Battery; Published: 24-Mar-1999; LatestRevisionDate: 17-Jul-2002; LatestRevisionNote: Re-released for DXP Platform.; PackageReference: BAT-2; Publisher: Altium Limited; PackageDescription: Battery; 2 Leads
C2 C4-C13 C15 C17 C19 C20 C22-C25 C27 C29-C39 C41-C87 = Cap: Capacitor; Published: 8-Jun-2000; LatestRevisionDate: 17-Jul-2002; LatestRevisionNote: Re-released for DXP Platform.; PackageReference: RAD-0.3; Publisher: Altium Limited; PackageDescription: Radial Cap, Thru-Hole; 2 Leads; 0.3 in Pin Spacing
CB1 = Header 3: Header, 3-Pin; LatestRevisionDate: 17-Jul-2002; LatestRevisionNote: Re-released for DXP Platform.; Publisher: Altium Limited
D1-D6 = Diode: Default Diode; Published: 8-Jun-2000; LatestRevisionDate: 17-Jul-2002; LatestRevisionNote: Re-released for DXP Platform.; PackageVersion: Sep-1996; PackageReference: SMC; Publisher: Altium Limited; PackageDescription: DO-214-AB/SMC; 2 C-Bend Leads; Body 7.9 x 5.9 mm, inc. leads (LxW); Code_JEDEC: DO-214-AB
D8 = D Zener: Zener Diode; Published: 8-Jun-2000; LatestRevisionDate: 17-Jul-2002; LatestRevisionNote: Re-released for DXP Platform.; PackageReference: DIODE-0.7; Publisher: Altium Limited; PackageDescription: Diode, Thru-Hole; 2 Leads; 0.7 in Pin Spacing
DEPLOY2 = MOSFET-N: N-Channel MOSFET; pin to pad: 1>3 2>1 3>2; Published: 8-Jun-2000; LatestRevisionDate: 17-Jul-2002; LatestRevisionNote: Re-released for DXP Platform.; PackageVersion: 1995/1996; PackageReference: E3; Publisher: Altium Limited; PackageDescription: TO, Flat Index; 3 In-Line, Axial Leads; Body Dia. 4.6mm; Lead Dia. 0.5 mm (max)
FET1-FET4 = Mosfet
L1 L3 L5 L7-L10 = Inductor: Code_IEC: 1005; Published: 8-Jun-2000; LatestRevisionDate: 29-May-2009; LatestRevisionNote: IPC-7351 Footprint Added.; PackageReference: 0402-A; Publisher: Altium Limited; PackageDescription: Chip Inductor; Code_JEITA: 0402
L2 L4 L6 = 744325240: SMD Flat Wire High Current Inductor WE-HCI, L=2.40 µH; DatasheetVersion: ver 2, Jan-2008; PackageVersion: 2008; PackageReference: WE-HCI-1050; PackageDescription: SMD Inductor, 2-Leads, Body 10.5 x 10.2 mm; ComponentLink1Description: Manufacturer URL; ComponentLink1URL: http://www.we-online.com; ComponentLink2Description: Datasheet; ComponentLink2URL: http://www.we-online.de/katalog/media/pdf/744325240.pdf
P1 = Header 8: Header, 8-Pin; LatestRevisionDate: 17-Jul-2002; LatestRevisionNote: Re-released for DXP Platform.; Publisher: Altium Limited
Q1a Q1b Q2a Q2b Q3a Q3b Q4a Q4b Q5a Q5b Q6a Q6b Q7 Q7a Q7b = MOSFET-P: P-Channel MOSFET; Published: 8-Jun-2000; LatestRevisionDate: 17-Jul-2002; LatestRevisionNote: Re-released for DXP Platform.; PackageVersion: 1995/1996; PackageReference: E3; Publisher: Altium Limited; PackageDescription: TO, Flat Index; 3 In-Line, Axial Leads; Body Dia. 4.6mm; Lead Dia. 0.5 mm (max)
R1-R52 R54-R64 RFB1-RFB4 = Res1: Resistor; Published: 8-Jun-2000; LatestRevisionDate: 17-Jul-2002; LatestRevisionNote: Re-released for DXP Platform.; PackageReference: AXIAL-0.3; Publisher: Altium Limited; PackageDescription: Axial Device, Thru-Hole; 2 Leads; 0.3 in Pin Spacing
STM1 = STM32F103R6T6: STM32 ARM-based 32-bit MCU with 32 Kbytes Flash, 64-pin LQFP, Industrial Temperature; Published: 30-May-2008; DatasheetVersion: rev6, Mar-2008; PackageVersion: Mar-2008; PackageReference: LQFP64; Publisher: Altium Limited; PackageDescription: 64-Pin Low-Profile Quad Flat Pack, 10 x 10 mm Body, 0.5 mm Pitch (LQFP64); ComponentLink1Description: Manufacturer Link; ComponentLink1URL: www.st.com/stm32; ComponentLink2Description: Datasheet; ComponentLink2URL: http://www.st.com/stonline/products/literature/ds/13587.pdf
U1-U5 U8 = MCP1416T-E/OT: Tiny 1.5A, High-Speed Power MOSFET Driver, Non Inverting, Extended Temperature, Tape and Reel; Published: 29-Jan-2009; LatestRevisionDate: 02-Dec-2009; LatestRevisionNote: Updated datasheet to version revC, Dec-2008.; DatasheetVersion: revC, Dec-2008; PackageVersion: revBB, Aug-2009; PackageReference: SOT-23-OT5; Publisher: Altium Limited; PackageDescription: 5-Lead Plastic Small Outline Transistor (OT) [SOT-23]; Supplier 1: Digi-Key; Supplier Part Number 1: MCP1416T-E/OTTR-ND; Supplier 2: Digi-Key; Supplier Part Number 2: MCP1416T-E/OTCT-ND; Supplier 3: Digi-Key; Supplier Part Number 3: MCP1416T-E/OTDKR-ND; Supplier 4: Farnell; Supplier Part Number 4: 1630421; Code_IPC: SOT23-5; ComponentLink1Description: Datasheet; ComponentLink1URL: http://ww1.microchip.com/downloads/en/DeviceDoc/22092c.pdf; ComponentLink2Description: Packaging Specification; ComponentLink2URL: http://www.microchip.com/stellent/groups/techpub_sg/documents/packagingspec/en012702.pdf; ComponentLink3Description: Microchip.com Home; ComponentLink3URL: http://www.microchip.com/
U6 U7 = TC74A0-5.0VCTTR: Tiny Serial Digital Thermal Sensor, 5-Pin SOT-23, Extended Temperature, Tape and Reel; Published: 29-Jan-2009; DatasheetVersion: revC, Oct-2002; PackageVersion: revBB, Aug-2009; PackageReference: SOT-23-CT5; Publisher: Altium Limited; PackageDescription: 5-Lead Plastic Small Outline Transistor (CT) [SOT-23]; Supplier 1: Digi-Key; Supplier Part Number 1: TC74A0-5.0VCTTR-ND; Supplier 2: Digi-Key; Supplier Part Number 2: TC74A0-5.0VCTCT-ND; Supplier 3: Digi-Key; Supplier Part Number 3: TC74A0-5.0VCTDKR-ND; Supplier 4: Farnell; Supplier Part Number 4: 9762671; Code_IPC: SOT23-5; ComponentLink1Description: Datasheet; ComponentLink1URL: http://ww1.microchip.com/downloads/en/DeviceDoc/21462c.pdf; ComponentLink2Description: Packaging Specification; ComponentLink2URL: http://www.microchip.com/stellent/groups/techpub_sg/documents/packagingspec/en012702.pdf; ComponentLink3Description: Microchip.com Home; ComponentLink3URL: http://www.microchip.com/
U9 = MCP1416T-E/OT: Tiny 1.5A, High-Speed Power MOSFET Driver, Non Inverting, Extended Temperature, Tape and Reel; Manufacturer: Microchip; DatasheetVersion: revC, Dec-2008; PackageVersion: revBB, Aug-2009; PackageReference: SOT-23-OT5; PackageDescription: 5-Lead Plastic Small Outline Transistor (OT) [SOT-23]; Supplier 1: Digi-Key; Supplier Part Number 1: MCP1416T-E/OTTR-ND; Supplier 2: Digi-Key; Supplier Part Number 2: MCP1416T-E/OTCT-ND; Supplier 3: Digi-Key; Supplier Part Number 3: MCP1416T-E/OTDKR-ND; Supplier 4: Farnell; Supplier Part Number 4: 1630421RL; Supplier 5: Farnell; Supplier Part Number 5: 1630421; Supplier 6: Newark; Supplier Part Number 6: 02P6620; Supplier 7: Newark; Supplier Part Number 7: 77M2548; Supplier 8: Mouser; Supplier Part Number 8: 579-MCP1416T-E/OT; Mounting Technology: Surface Mount; Code_IPC: SOT23-5; PartNumber: MCP1416T-E/OT; ComponentLink1Description: Manufacturer URL; ComponentLink1URL: http://www.microchip.com/; ComponentLink2Description: Datasheet; ComponentLink2URL: http://ww1.microchip.com/downloads/en/DeviceDoc/22092c.pdf; ComponentLink3Description: Package Specification; ComponentLink3URL: http://www.microchip.com/stellent/groups/techpub_sg/documents/packagingspec/en012702.pdf
W1-W8 = Jumper: Jumper Wire; Published: 24-Mar-1999; LatestRevisionDate: 17-Jul-2002; LatestRevisionNote: Re-released for DXP Platform.; PackageReference: RAD-0.2; Publisher: Altium Limited; PackageDescription: Radial Cap, Thru-Hole; 2 Leads; 0.2 in Pin Spacing